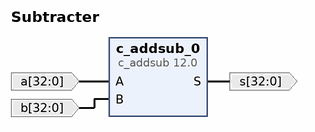
[diagram p0: block diagram of the top level]
# Vivado block design Subtracter, xc7a35ticsg324-1L, Vivado 2022.2
create_bd_design Subtracter

create_bd_port -dir I -from 32 -to 0 -type data a
create_bd_port -dir I -from 32 -to 0 -type data b
create_bd_port -dir O -from 32 -to 0 -type data s

create_bd_cell -type ip -vlnv xilinx.com:ip:c_addsub:12.0 c_addsub_0
set_property -dict [list \
  CONFIG.A_Type Unsigned \
  CONFIG.A_Width 33 \
  CONFIG.Add_Mode Subtract \
  CONFIG.B_Type Unsigned \
  CONFIG.B_Value 000000000000000000000000000000000 \
  CONFIG.B_Width 33 \
  CONFIG.CE false \
  CONFIG.Implementation DSP48 \
  CONFIG.Latency 0 \
  CONFIG.Out_Width 33 \
] [get_bd_cells c_addsub_0]

# ---- connections ----

connect_bd_net [get_bd_ports a] [get_bd_pins c_addsub_0/A]
connect_bd_net [get_bd_ports b] [get_bd_pins c_addsub_0/B]
connect_bd_net [get_bd_pins c_addsub_0/S] [get_bd_ports s]

validate_bd_design
save_bd_design
